# Altium project Voltage Taps 8S RHS Bot V0.1.PrjPcb
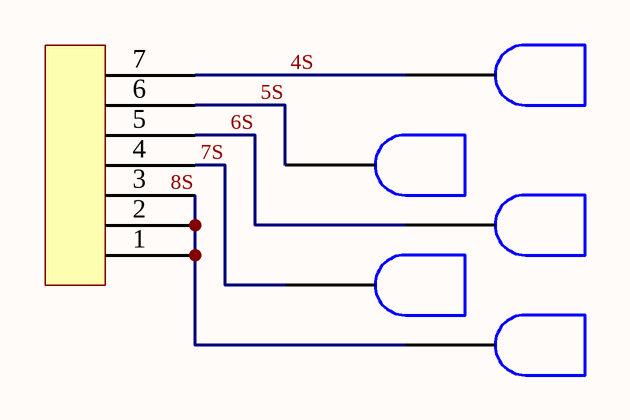
[diagram p0: VT 8S RHS Bot V0.1.SchDoc]
ProjectRevision: V0.1; ProjectTitle: Voltage Tap
1 sheet, 6 parts. Net scope: global (net labels, ports and power ports of the same name join across sheets).
Board file: VT 8S RHS Bot V0.1.PcbDoc

## Sheet VT 8S RHS Bot V0.1.SchDoc
size A4; SheetNumber: 1; SheetTotal: 1

### Parts
J1  Voltage Tap  [Voltage Tap]  (value not drawn)  (no BOM)
J2  Voltage Tap  [Voltage Tap]  (value not drawn)  (no BOM)
J3  Voltage Tap  [Voltage Tap]  (value not drawn)  (no BOM)
J4  Voltage Tap  [Voltage Tap]  (value not drawn)  (no BOM)
J5  84953-7-FPC  [84953-7 - FPC]  (value not drawn)  (no BOM)
J6  Voltage Tap  [Voltage Tap]  (value not drawn)  (no BOM)

### Nets
4S: J5.7 J6.1
5S: J4.1 J5.6
6S: J3.1 J5.5
7S: J2.1 J5.4
8S: J1.1 J5.1 J5.2 J5.3

### Library data of the parts
J5 = 84953-7-FPC: FPC Connectors, Flex-to-Board, 7 Position, .039 in [1 mm] Centerline, FPC Side Connector

## Assembly variants
Manufacture: all parts fitted